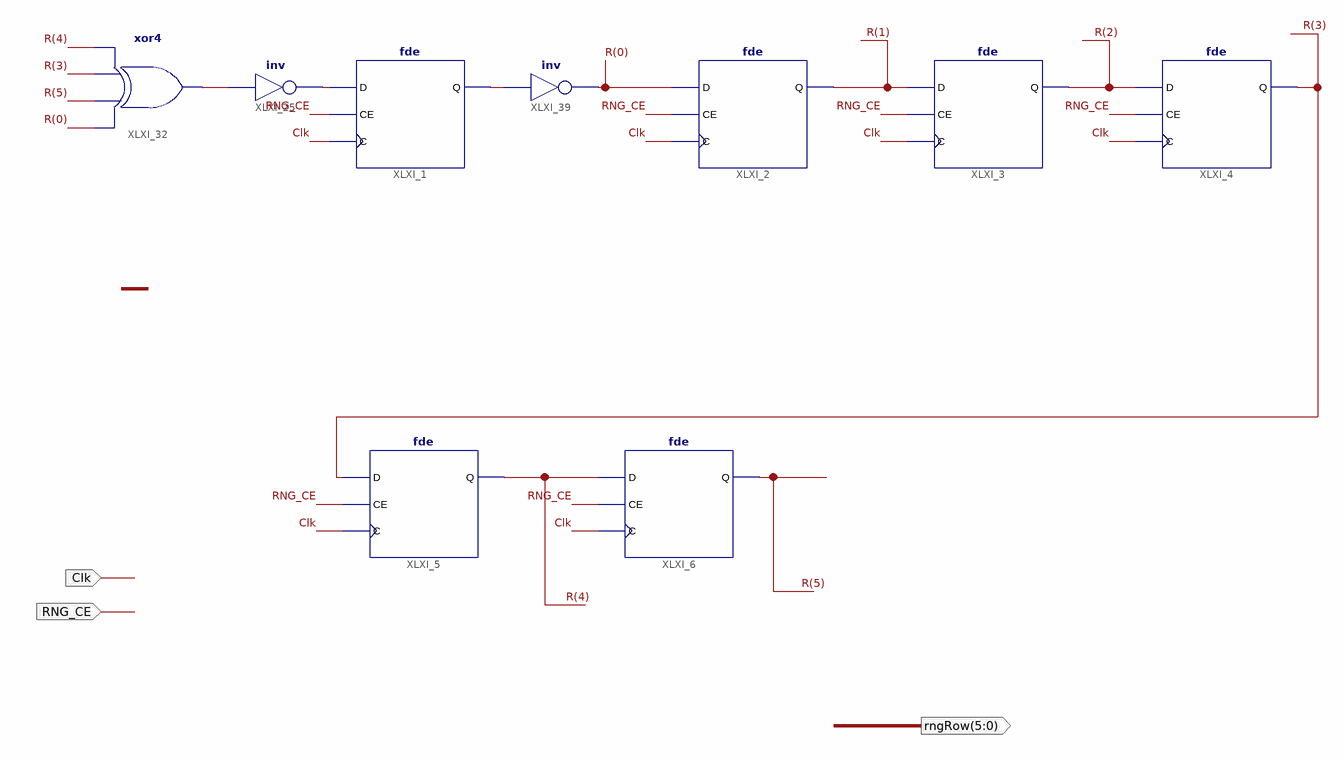
[diagram p0: schematic sheet 1]
// Xilinx ISE schematic LFSR_RNG.sch (spartan3e) as structural Verilog: 9 symbols, 3 ports
module LFSR_RNG (
  input  Clk,
  input  RNG_CE,
  output [5:0] rngRow
);

  wire XLXN_60, XLXN_61, XLXN_69;
  wire [5:0] R;

  fde XLXI_6 (.C(Clk), .CE(RNG_CE), .D(R[4]), .Q(R[5]));
  fde XLXI_5 (.C(Clk), .CE(RNG_CE), .D(R[3]), .Q(R[4]));
  fde XLXI_1 (.C(Clk), .CE(RNG_CE), .D(XLXN_60), .Q(XLXN_69));
  fde XLXI_4 (.C(Clk), .CE(RNG_CE), .D(R[2]), .Q(R[3]));
  fde XLXI_3 (.C(Clk), .CE(RNG_CE), .D(R[1]), .Q(R[2]));
  fde XLXI_2 (.C(Clk), .CE(RNG_CE), .D(R[0]), .Q(R[1]));
  not XLXI_25 (XLXN_60, XLXN_61);
  xor XLXI_32 (XLXN_61, R[0], R[5], R[3], R[4]);
  not XLXI_39 (R[0], XLXN_69);
endmodule
